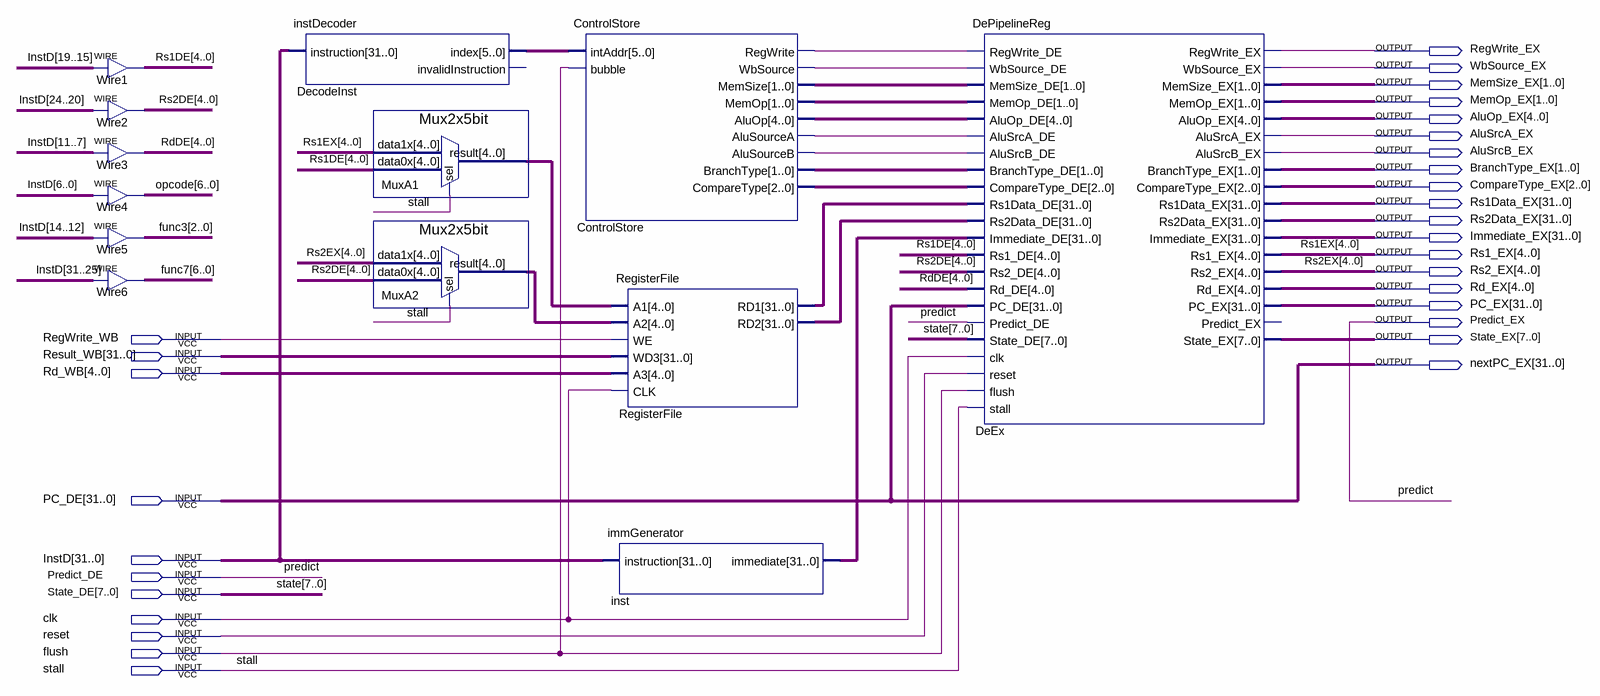
[diagram p0: schematic sheet]
// Quartus schematic Decode.bdf as structural Verilog: 13 symbols, 30 pins
module Decode (
  input  RegWrite_WB,
  input  [31:0] Result_WB,
  input  [4:0] Rd_WB,
  input  [31:0] PC_DE,
  input  [31:0] InstD,
  input  Predict_DE,
  input  [7:0] State_DE,
  input  clk,
  input  reset,
  input  flush,
  input  stall,
  output RegWrite_EX,
  output WbSource_EX,
  output [1:0] MemSize_EX,
  output [1:0] MemOp_EX,
  output [4:0] AluOp_EX,
  output AluSrcA_EX,
  output AluSrcB_EX,
  output [1:0] BranchType_EX,
  output [2:0] CompareType_EX,
  output [31:0] Rs1Data_EX,
  output [31:0] Rs2Data_EX,
  output [31:0] Immediate_EX,
  output [4:0] Rs1_EX,
  output [4:0] Rs2_EX,
  output [4:0] Rd_EX,
  output [31:0] PC_EX,
  output Predict_EX,
  output [7:0] State_EX,
  output [31:0] nextPC_EX
);

  wire ControlStore_alusourcea, ControlStore_alusourceb, ControlStore_regwrite, ControlStore_wbsource;
  wire [1:0] ControlStore_branchtype, ControlStore_memop, ControlStore_memsize;
  wire [2:0] ControlStore_comparetype, func3;
  wire [4:0] ControlStore_aluop, MuxA1_result, MuxA2_result, RdDE, Rs1DE, Rs2DE;
  wire [5:0] DecodeInst_index;
  wire [6:0] func7, opcode;
  wire [31:0] inst_immediate, RegisterFile_rd1, RegisterFile_rd2;

  assign Rs1DE = InstD[19:15];  // WIRE Wire1
  assign Rs2DE = InstD[24:20];  // WIRE Wire2
  assign RdDE = InstD[11:7];  // WIRE Wire3
  assign opcode = InstD[6:0];  // WIRE Wire4
  assign func3 = InstD[14:12];  // WIRE Wire5
  assign func7 = InstD[31:25];  // WIRE Wire6
  instDecoder DecodeInst (.instruction(InstD), .index(DecodeInst_index));  // open: invalidInstruction
  Mux2x5bit MuxA1 (.data1x(Rs1_EX), .data0x(Rs1DE), .sel(stall), .result(MuxA1_result));
  Mux2x5bit MuxA2 (.data1x(Rs2_EX), .data0x(Rs2DE), .sel(stall), .result(MuxA2_result));
  ControlStore ControlStore (
    .intAddr(DecodeInst_index), .bubble(flush), .RegWrite(ControlStore_regwrite),
    .WbSource(ControlStore_wbsource), .MemSize(ControlStore_memsize), .MemOp(ControlStore_memop),
    .AluOp(ControlStore_aluop), .AluSourceA(ControlStore_alusourcea), .AluSourceB(ControlStore_alusourceb),
    .BranchType(ControlStore_branchtype), .CompareType(ControlStore_comparetype));
  RegisterFile RegisterFile (
    .A1(MuxA1_result), .A2(MuxA2_result), .WE(RegWrite_WB), .WD3(Result_WB), .A3(Rd_WB), .CLK(clk),
    .RD1(RegisterFile_rd1), .RD2(RegisterFile_rd2));
  immGenerator inst (.instruction(InstD), .immediate(inst_immediate));
  DePipelineReg DeEx (
    .RegWrite_DE(ControlStore_regwrite), .WbSource_DE(ControlStore_wbsource),
    .MemSize_DE(ControlStore_memsize), .MemOp_DE(ControlStore_memop), .AluOp_DE(ControlStore_aluop),
    .AluSrcA_DE(ControlStore_alusourcea), .AluSrcB_DE(ControlStore_alusourceb),
    .BranchType_DE(ControlStore_branchtype), .CompareType_DE(ControlStore_comparetype),
    .Rs1Data_DE(RegisterFile_rd1), .Rs2Data_DE(RegisterFile_rd2), .Immediate_DE(inst_immediate),
    .Rs1_DE(Rs1DE), .Rs2_DE(Rs2DE), .Rd_DE(RdDE), .PC_DE(PC_DE), .Predict_DE(Predict_DE),
    .State_DE(State_DE), .clk(clk), .reset(reset), .flush(flush), .stall(stall), .RegWrite_EX(RegWrite_EX),
    .WbSource_EX(WbSource_EX), .MemSize_EX(MemSize_EX), .MemOp_EX(MemOp_EX), .AluOp_EX(AluOp_EX),
    .AluSrcA_EX(AluSrcA_EX), .AluSrcB_EX(AluSrcB_EX), .BranchType_EX(BranchType_EX),
    .CompareType_EX(CompareType_EX), .Rs1Data_EX(Rs1Data_EX), .Rs2Data_EX(Rs2Data_EX),
    .Immediate_EX(Immediate_EX), .Rs1_EX(Rs1_EX), .Rs2_EX(Rs2_EX), .Rd_EX(Rd_EX), .PC_EX(PC_EX),
    .State_EX(State_EX));  // open: Predict_EX

  assign nextPC_EX = PC_DE;
  assign Predict_EX = Predict_DE;

  // Other names for the same wires on the sheet: predict = Predict_DE; Rs1EX[4:0] = Rs1_EX; Rs2EX[4:0] = Rs2_EX;
  //   state[7:0] = State_DE
endmodule
